# EAGLE design chipchestra-v05-joystick (EAGLE 8.0.0)
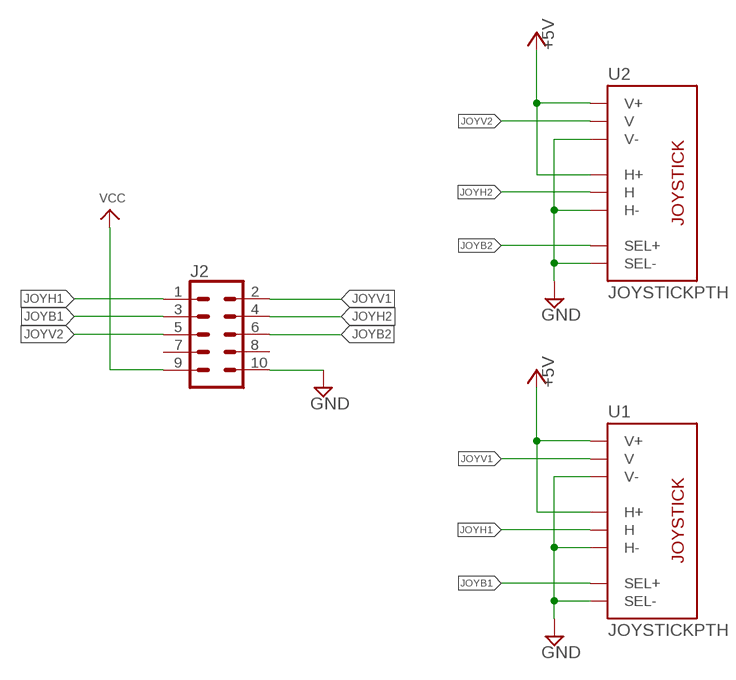
[diagram p0: schematic, sheet 1]

## Parts
J2  CONN_05X2SHD_LOCK  [2X5-SHROUDED_LOCK]
U1  JOYSTICKPTH  [JOYSTICK]
U2  JOYSTICKPTH  [JOYSTICK]

## Nets
+5V: U1.H1(H+) U1.V1(V+) U2.H1(H+) U2.V1(V+)
GND: J2.10 U1.B2A(SEL-) U1.H3(H-) U1.V3(V-) U2.B2A(SEL-) U2.H3(H-) U2.V3(V-)
JOYB1: J2.3 U1.B1A(SEL+)
JOYB2: J2.6 U2.B1A(SEL+)
JOYH1: J2.1 U1.H2(H)
JOYH2: J2.4 U2.H2(H)
JOYV1: J2.2 U1.V2(V)
JOYV2: J2.5 U2.V2(V)
VCC: J2.9
Unconnected: J2.7 J2.8

## Library data of the parts
J2 = SparkFun-Connectors:CONN_05X2: Multi connection point. Often used as Generic Header-pin footprint for 0.1 inch spaced/style header connections For AVR SPI programming port, see special device with nice symbol: "AVR_SPI_PROG_5x2.dev" You can populate with any combo of single row headers, but if you'd like an exact match, check these: 2x5 AVR ICSP Male Header <https://www.sparkfun.com/products/778> (PRT-00778) 2x5 Pin Shrouded Header <https://www.sparkfun.com/products/8506> (PRT-08506) On any of the 0.1 inch spaced packages, you can populate with these: Break Away Headers - Straight <https://www.sparkfun.com/products/116> (PRT-00116) Break Away Male Headers - Right Angle <https://www.sparkfun.com/products/553> (PRT-00553) Female Headers <https://www.sparkfun.com/products/115> (PRT-00115) Break Away Headers - Machine Pin <https://www.sparkfun.com/products/117> (PRT-00117) Break Away Female Headers - Swiss Machine Pin <https://www.sparkfun.com/products/743> (PRT-00743) Special note: the shrouded connector mates well with our 5x2 ribbon cables: 2x5 Pin IDC Ribbon Cable <https://www.sparkfun.com/products/8535> (PRT-08535); PROD_ID: CONN-08671; SF_ID: PRT-08506
U1 U2 = adafruit:JOYSTICK: Thumb Joystick Joystick commonly found in PS2 controllers. Two pots and a select switch. Adapted from Sparkfun Library (but for more common 6mm switch sticks)

## Net classes
0 default: width 0.305 mm, clearance 0.152 mm

## Board
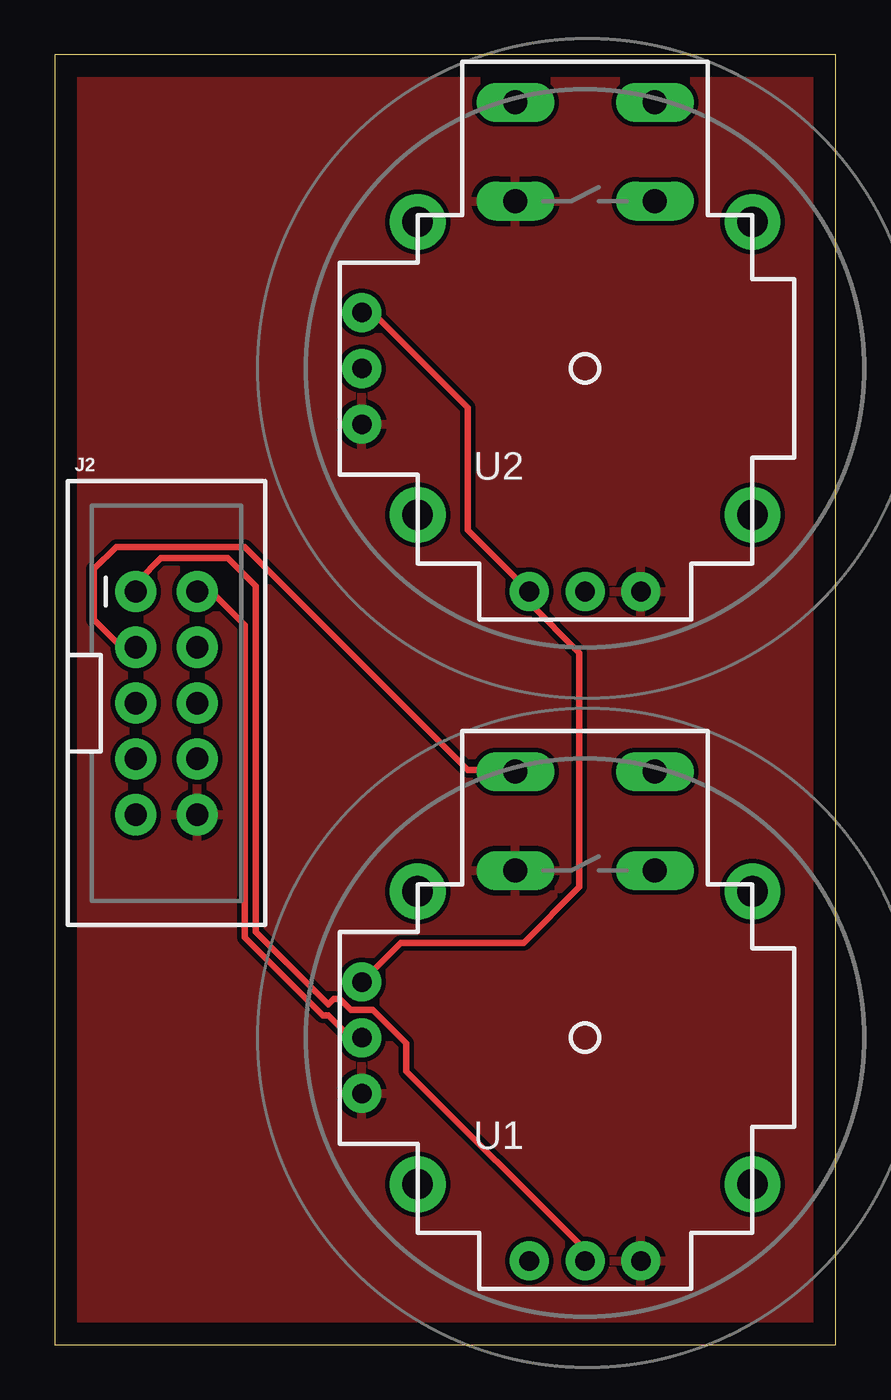
[diagram p1: board, top side]
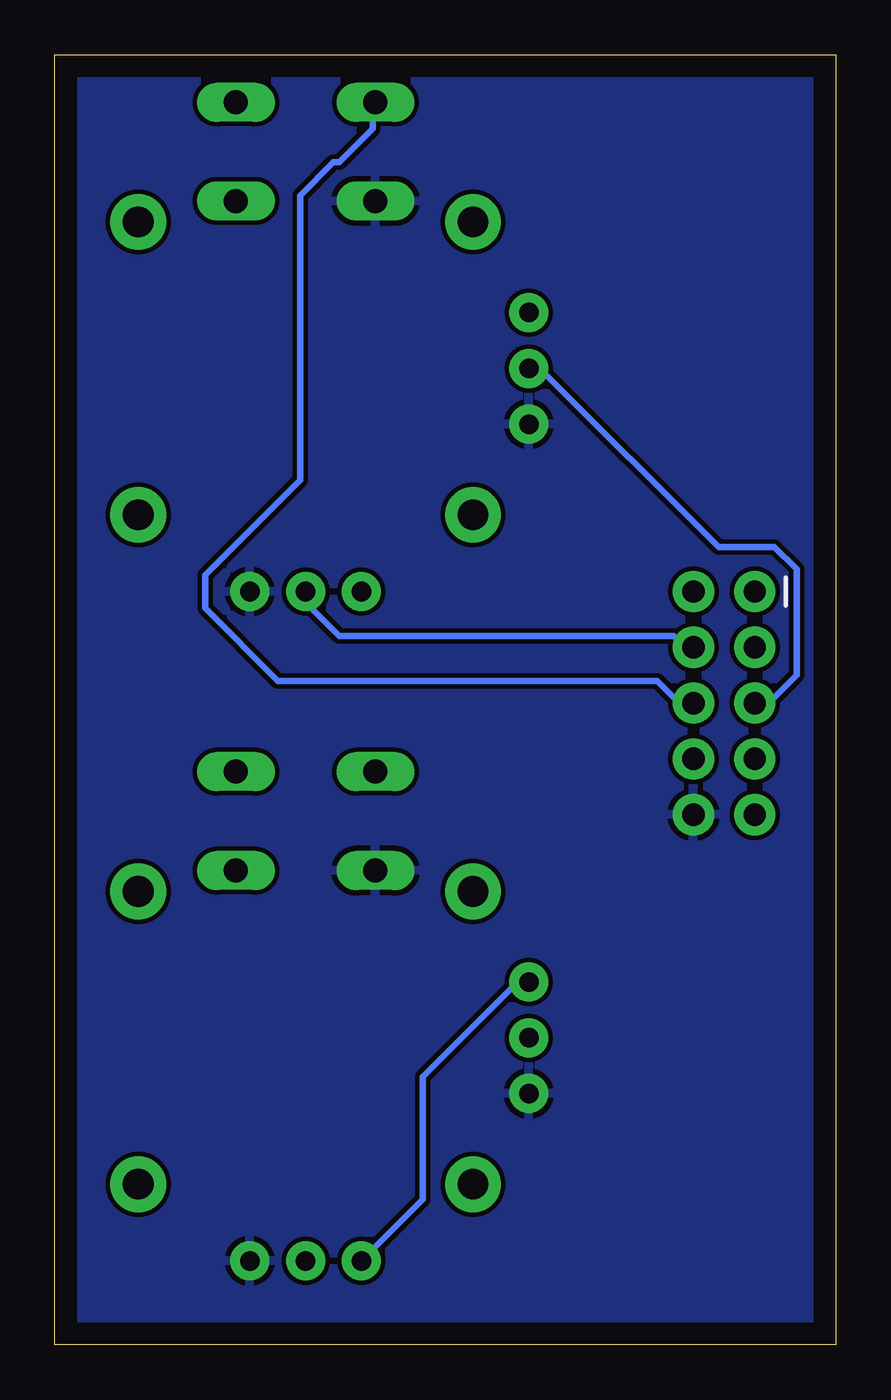
[diagram p2: board, bottom side, seen from below]

Size 35.54 x 58.73 mm. Coordinates in mm from the lower left corner, seen from the top.
Outline: 0,0 35.54,0 35.54,58.73 0,58.73 0,0
Copper layers (1*16): Top 0.035mm / dielectric 1.5mm / Bottom 0.035mm
Design rules "default": minimum track width 10mil, minimum drill 24mil, track to track 8mil, track to pad 8mil, pad to pad 8mil, via to via 8mil, smd to smd 8mil, copper to edge 40mil, drill to drill 8mil, minimum pad ring 10mil, minimum via ring 8mil, stop-mask expansion 4mil, vias tented up to drill 0mil, thermal gap 10mil

### Footprints (pad centres in the part's own frame; a part is rotated, then mirrored left to right if it is on the bottom)
2X5-SHROUDED_LOCK = drill 1.016 pad 1.88: 1 -1.397,5.08; 2 1.397,5.08; 3 -1.397,2.54; 4 1.397,2.54; 5 -1.397,0; 6 1.397,0; 7 -1.397,-2.54; 8 1.397,-2.54; 9 -1.397,-5.08; 10 1.397,-5.08
JOYSTICK = drill 1.1 pad 1.778 long: B1A -3.175,12.12; B1B 3.175,12.12; B2A -3.175,7.62; B2B 3.175,7.62 | drill 0.889 pad 1.778: H1 -2.54,-10.16; H2 0,-10.16; H3 2.54,-10.16; V1 -10.16,2.54; V2 -10.16,0; V3 -10.16,-2.54 | drill 1.397 pad 2.54: MOUNT1 -7.62,6.668; MOUNT2 -7.62,-6.668; MOUNT3 7.62,-6.668; MOUNT4 7.62,6.668

### Placement (x,y rotation side)
J2  5.08,29.21 0 top
U1  24.13,13.97 0 top
U2  24.13,44.45 0 top

### Tracks (layer width: path | path; a pad name or v marks a point on that pad's centre or on a via)
+5V
  Top 0.305: U2.V1 14.48,46.99 18.8,42.67 18.8,37.08 U2.H1 21.59,33.78 23.88,31.5 23.88,20.83 21.34,18.29 15.75,18.29 U1.V1
  Bottom 0.305: U1.H1 18.8,6.6 18.8,12.19 14.48,16.51 U1.V1
GND
  pour Bottom: -1.27,59.69 36.83,59.69 36.83,-1.27 -1.27,-1.27
  pour Top: -2.54,60.96 39.37,60.96 39.37,-2.54 -2.54,-2.54
JOYB1
  Top 0.305: J2.3 3.05,31.75 1.78,33.02 1.78,35.31 2.79,36.32 8.64,36.32 18.8,26.16 20.83,26.16 U1.B1A
JOYB2
  Bottom 0.305: J2.6 7.11,29.21 8.13,30.23 25.4,30.23 28.7,33.53 28.7,35.05 24.38,39.37 24.38,52.32 22.86,53.85 22.61,53.85 21.08,55.37 21.08,56.39 U2.B1A
JOYH1
  Top 0.305: U1.H2 24.13,4.32 16,12.45 16,13.72 14.48,15.24 13.46,15.24 12.95,15.75 12.7,15.75 12.45,15.49 9.14,18.8 9.14,34.54 7.87,35.81 4.83,35.81 3.81,34.8 3.81,34.29 J2.1
JOYH2
  Bottom 0.305: U2.H2 24.13,33.78 22.61,32.26 7.37,32.26 6.86,31.75 J2.4
JOYV1
  Top 0.305: U1.V2 13.46,13.97 12.45,14.99 12.19,14.99 8.64,18.54 8.64,32.77 7.11,34.29 J2.2
JOYV2
  Bottom 0.305: U2.V2 13.46,44.45 5.33,36.32 2.79,36.32 1.78,35.31 1.78,30.48 3.05,29.21 J2.5